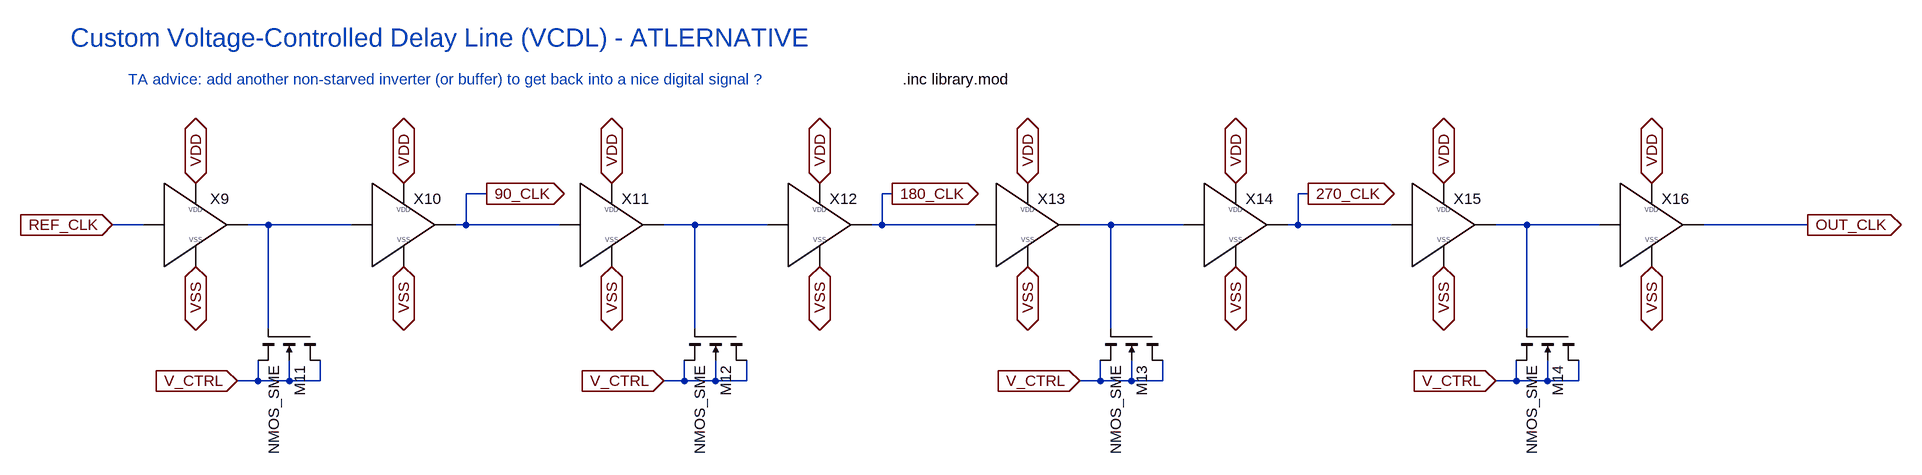
[diagram p0: schematic my_vcdl_alt.asc]
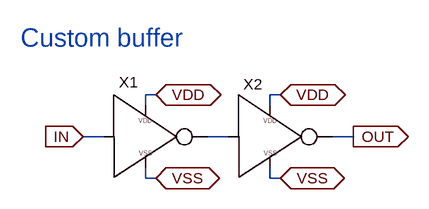
[diagram p1: sub-circuit my_buffer.asc]
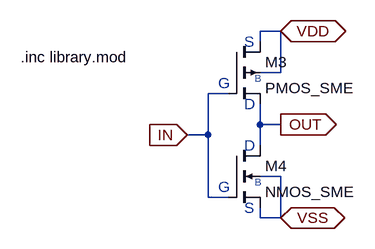
[diagram p2: sub-circuit my_inverter.asc]
my_vcdl_alt.asc, the LTspice schematic file:
Version 4.1
SHEET 1 2968 1064
WIRE 400 96 368 96
WIRE 1024 96 1008 96
WIRE 1664 96 1648 96
WIRE -128 144 -176 144
WIRE 64 144 32 144
WIRE 192 144 64 144
WIRE 368 144 368 96
WIRE 368 144 352 144
WIRE 512 144 368 144
WIRE 720 144 672 144
WIRE 832 144 720 144
WIRE 1008 144 1008 96
WIRE 1008 144 992 144
WIRE 1152 144 1008 144
WIRE 1360 144 1312 144
WIRE 1472 144 1360 144
WIRE 1648 144 1648 96
WIRE 1648 144 1632 144
WIRE 1792 144 1648 144
WIRE 2000 144 1952 144
WIRE 2112 144 2000 144
WIRE 2432 144 2272 144
WIRE 64 304 64 144
WIRE 720 304 720 144
WIRE 1360 304 1360 144
WIRE 2000 304 2000 144
WIRE 48 384 48 352
WIRE 48 384 16 384
WIRE 96 384 96 352
WIRE 96 384 48 384
WIRE 144 384 144 352
WIRE 144 384 96 384
WIRE 704 384 704 352
WIRE 704 384 672 384
WIRE 752 384 752 352
WIRE 752 384 704 384
WIRE 800 384 800 352
WIRE 800 384 752 384
WIRE 1344 384 1344 352
WIRE 1344 384 1312 384
WIRE 1392 384 1392 352
WIRE 1392 384 1344 384
WIRE 1440 384 1440 352
WIRE 1440 384 1392 384
WIRE 1984 384 1984 352
WIRE 1984 384 1952 384
WIRE 2032 384 2032 352
WIRE 2032 384 1984 384
WIRE 2080 384 2080 352
WIRE 2080 384 2032 384
FLAG -176 144 REF_CLK
IOPIN -176 144 In
FLAG -48 80 VDD
IOPIN -48 80 BiDir
FLAG 272 80 VDD
IOPIN 272 80 BiDir
FLAG -48 208 VSS
IOPIN -48 208 BiDir
FLAG 272 208 VSS
IOPIN 272 208 BiDir
FLAG 592 80 VDD
IOPIN 592 80 BiDir
FLAG 912 80 VDD
IOPIN 912 80 BiDir
FLAG 592 208 VSS
IOPIN 592 208 BiDir
FLAG 912 208 VSS
IOPIN 912 208 BiDir
FLAG 1232 80 VDD
IOPIN 1232 80 BiDir
FLAG 1552 80 VDD
IOPIN 1552 80 BiDir
FLAG 1232 208 VSS
IOPIN 1232 208 BiDir
FLAG 1552 208 VSS
IOPIN 1552 208 BiDir
FLAG 1872 80 VDD
IOPIN 1872 80 BiDir
FLAG 2192 80 VDD
IOPIN 2192 80 BiDir
FLAG 1872 208 VSS
IOPIN 1872 208 BiDir
FLAG 2192 208 VSS
IOPIN 2192 208 BiDir
FLAG 2432 144 OUT_CLK
IOPIN 2432 144 Out
FLAG 400 96 90_CLK
IOPIN 400 96 Out
FLAG 1024 96 180_CLK
IOPIN 1024 96 Out
FLAG 1664 96 270_CLK
IOPIN 1664 96 Out
FLAG 16 384 V_CTRL
IOPIN 16 384 In
FLAG 672 384 V_CTRL
IOPIN 672 384 In
FLAG 1312 384 V_CTRL
IOPIN 1312 384 In
FLAG 1952 384 V_CTRL
IOPIN 1952 384 In
SYMBOL my_buffer -64 144 R0
SYMATTR InstName X9
SYMBOL my_buffer 256 144 R0
SYMATTR InstName X10
SYMBOL my_buffer 576 144 R0
SYMATTR InstName X11
SYMBOL my_buffer 896 144 R0
SYMATTR InstName X12
SYMBOL my_buffer 1216 144 R0
SYMATTR InstName X13
SYMBOL my_buffer 1536 144 R0
SYMATTR InstName X14
SYMBOL my_buffer 1856 144 R0
SYMATTR InstName X15
SYMBOL my_buffer 2176 144 R0
SYMATTR InstName X16
SYMBOL nmos4 144 304 R90
SYMATTR InstName M11
SYMATTR Value NMOS_SME
SYMATTR Value2 l=3.5u w=4u
SYMBOL nmos4 800 304 R90
SYMATTR InstName M12
SYMATTR Value NMOS_SME
SYMATTR Value2 l=3.5u w=4u
SYMBOL nmos4 1440 304 R90
SYMATTR InstName M13
SYMATTR Value NMOS_SME
SYMATTR Value2 l=3.5u w=4u
SYMBOL nmos4 2080 304 R90
SYMATTR InstName M14
SYMATTR Value NMOS_SME
SYMATTR Value2 l=3.5u w=4u
TEXT -240 -144 Left 4 ;Custom Voltage-Controlled Delay Line (VCDL) - ATLERNATIVE
TEXT 1040 -80 Left 2 !.inc library.mod
TEXT -152 -80 Left 2 ;TA advice: add another non-starved inverter (or buffer) to get back into a nice digital signal ?

my_buffer.asc, the sub-circuit schematic file:
Version 4.1
SHEET 1 880 680
WIRE 112 144 96 144
WIRE 304 144 288 144
WIRE 96 160 96 144
WIRE 288 160 288 144
WIRE 32 208 0 208
WIRE 224 208 192 208
WIRE 416 208 384 208
WIRE 96 272 96 256
WIRE 112 272 96 272
WIRE 288 272 288 256
WIRE 304 272 288 272
FLAG 0 208 IN
IOPIN 0 208 In
FLAG 416 208 OUT
IOPIN 416 208 Out
FLAG 112 144 VDD
IOPIN 112 144 BiDir
FLAG 304 144 VDD
IOPIN 304 144 BiDir
FLAG 304 272 VSS
IOPIN 304 272 BiDir
FLAG 112 272 VSS
IOPIN 112 272 BiDir
SYMBOL my_inverter 96 208 R0
WINDOW 0 -26 -68 Bottom 2
SYMATTR InstName X1
SYMBOL my_inverter 288 208 R0
WINDOW 0 -26 -65 Bottom 2
SYMATTR InstName X2
TEXT -96 56 Left 4 ;Custom buffer

my_inverter.asc, the sub-circuit schematic file:
Version 4.1
SHEET 1 880 680
WIRE 608 -32 576 -32
WIRE 576 -16 576 -32
WIRE 608 32 608 -32
WIRE 608 32 576 32
WIRE 528 64 496 64
WIRE 576 112 576 80
WIRE 608 112 576 112
WIRE 496 128 496 64
WIRE 496 128 464 128
WIRE 576 144 576 112
WIRE 608 192 576 192
WIRE 496 224 496 128
WIRE 528 224 496 224
WIRE 576 256 576 240
WIRE 608 256 608 192
WIRE 608 256 576 256
FLAG 608 -32 VDD
IOPIN 608 -32 BiDir
FLAG 608 256 VSS
IOPIN 608 256 BiDir
FLAG 608 112 OUT
IOPIN 608 112 Out
FLAG 464 128 IN
IOPIN 464 128 In
SYMBOL pmos4 528 -16 R0
SYMATTR InstName M3
SYMATTR Value PMOS_SME
SYMATTR Value2 l=0.35u w=0.4u
SYMBOL nmos4 528 144 R0
SYMATTR InstName M4
SYMATTR Value NMOS_SME
SYMATTR Value2 l=0.35u w=0.4u
TEXT 552 -16 Left 2 ;S
TEXT 552 240 Left 2 ;S
TEXT 552 80 Left 2 ;D
TEXT 552 144 Left 2 ;D
TEXT 512 48 Left 2 ;G
TEXT 512 208 Left 2 ;G
TEXT 568 40 Left 1 ;B
TEXT 568 200 Left 1 ;B
TEXT 208 8 Left 2 !.inc library.mod

The netlist it stands for:
* my_vcdl_alt.asc
X§X9 REF_CLK N001 VDD VSS my_buffer
X§X10 N001 90_CLK VDD VSS my_buffer
X§X11 90_CLK N002 VDD VSS my_buffer
X§X12 N002 180_CLK VDD VSS my_buffer
X§X13 180_CLK N003 VDD VSS my_buffer
X§X14 N003 270_CLK VDD VSS my_buffer
X§X15 270_CLK N004 VDD VSS my_buffer
X§X16 N004 OUT_CLK VDD VSS my_buffer
M11 V_CTRL N001 V_CTRL V_CTRL NMOS_SME l=3.5u w=4u
M12 V_CTRL N002 V_CTRL V_CTRL NMOS_SME l=3.5u w=4u
M13 V_CTRL N003 V_CTRL V_CTRL NMOS_SME l=3.5u w=4u
M14 V_CTRL N004 V_CTRL V_CTRL NMOS_SME l=3.5u w=4u

* block symbol definitions
.subckt my_buffer IN OUT VDD VSS
X§X1 IN N001 VDD VSS my_inverter
X§X2 N001 OUT VDD VSS my_inverter
* Custom buffer
.ends my_buffer

.subckt my_inverter IN OUT VDD VSS
M3 VDD IN OUT VDD PMOS_SME l=0.35u w=0.4u
M4 OUT IN VSS VSS NMOS_SME l=0.35u w=0.4u
* S
* S
* D
* D
* G
* G
* B
* B
.inc library.mod
.ends my_inverter

.model NMOS NMOS
.model PMOS PMOS
.lib standard.mos
* Custom Voltage-Controlled Delay Line (VCDL) - ATLERNATIVE
.inc library.mod
* TA advice: add another non-starved inverter (or buffer) to get back into a nice digital signal ?
.backanno
.end